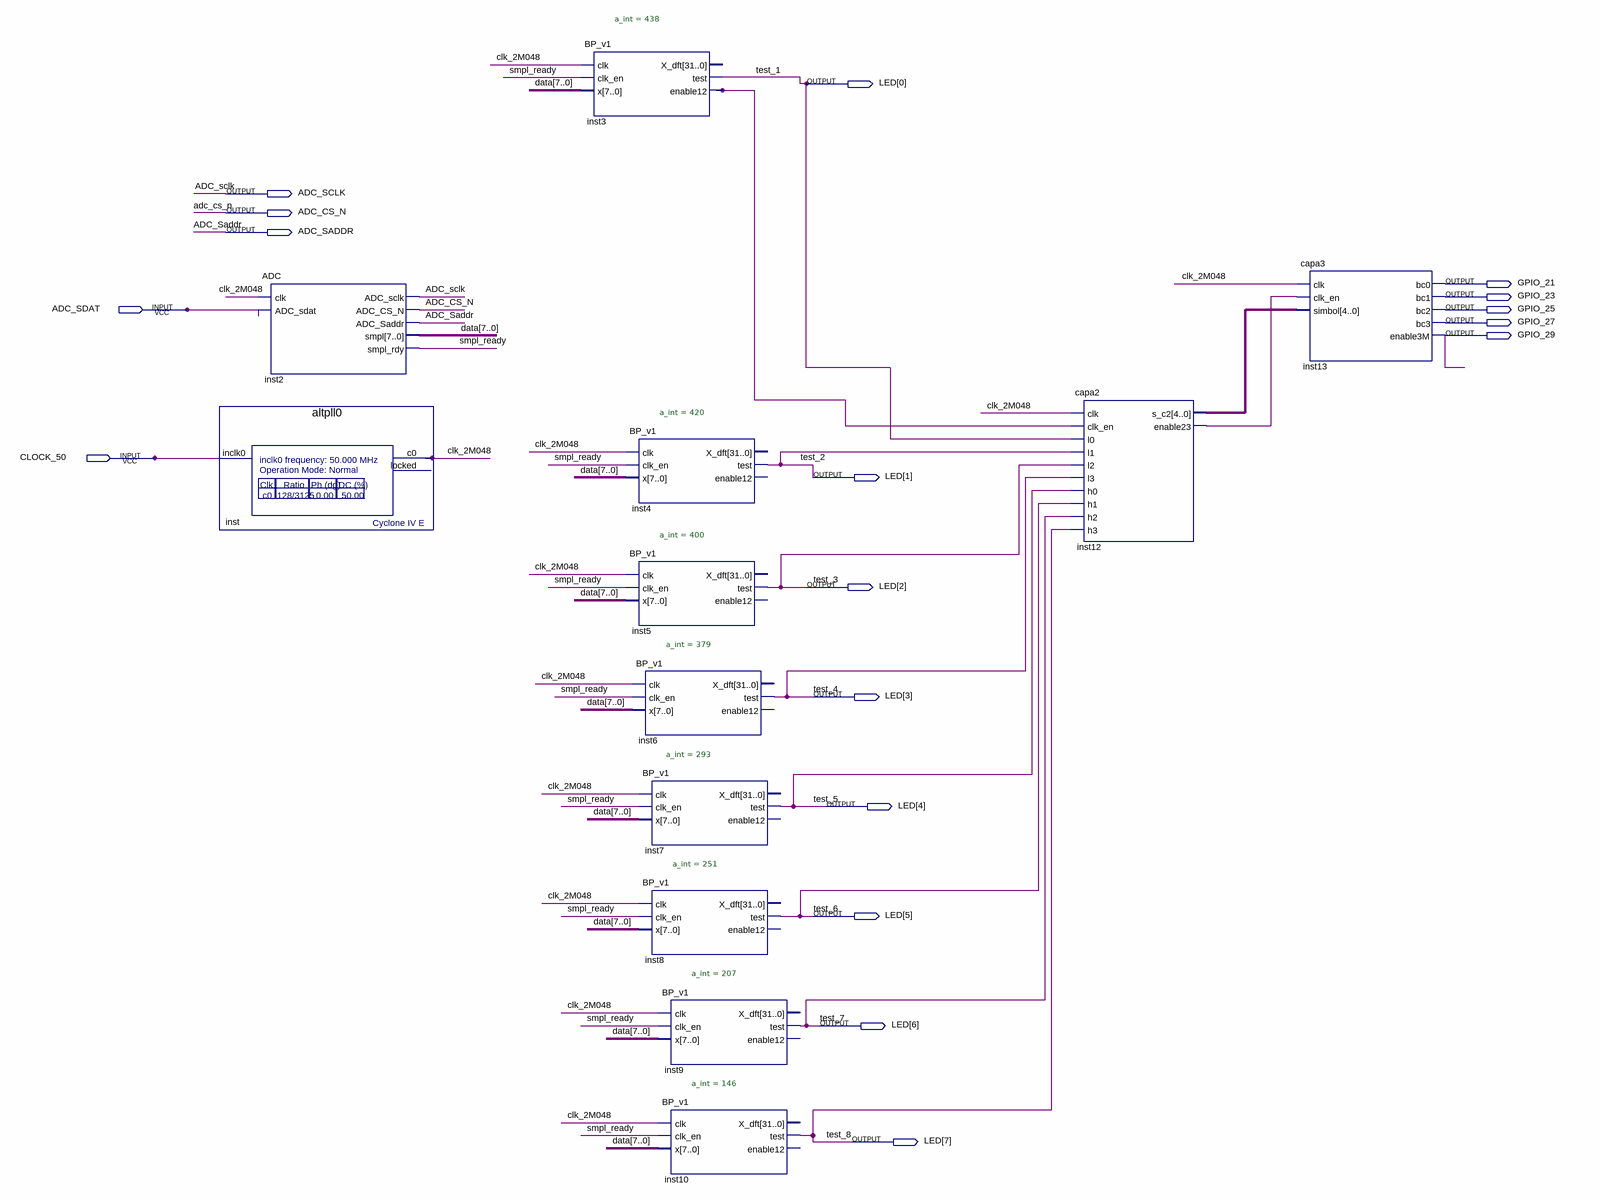
[diagram p0: schematic sheet]
// Quartus schematic main.bdf as structural Verilog: 12 symbols, 18 pins
module main (
  input  ADC_SDAT,
  input  CLOCK_50,
  output [7:0] LED,
  output ADC_SCLK,
  output ADC_CS_N,
  output ADC_SADDR,
  output GPIO_21,
  output GPIO_23,
  output GPIO_25,
  output GPIO_27,
  output GPIO_29
);

  wire clk_2M048, inst3_enable12, inst12_enable23, smpl_ready;
  wire [4:0] inst12_s_c2;
  wire [7:0] data;

  ADC inst2 (
    .clk(clk_2M048), .ADC_sdat(ADC_SDAT), .ADC_sclk(ADC_SCLK), .ADC_CS_N(ADC_CS_N), .ADC_Saddr(ADC_SADDR),
    .smpl(data), .smpl_rdy(smpl_ready));
  altpll0 inst (.inclk0(CLOCK_50), .c0(clk_2M048));  // open: locked
  BP_v1 #(.a_int(438)) inst3 (
    .clk(clk_2M048), .clk_en(smpl_ready), .x(data), .test(LED[0]), .enable12(inst3_enable12));  // open: X_dft
  BP_v1 #(.a_int(420)) inst4 (.clk(clk_2M048), .clk_en(smpl_ready), .x(data), .test(LED[1]));  // open: X_dft, enable12
  BP_v1 #(.a_int(400)) inst5 (.clk(clk_2M048), .clk_en(smpl_ready), .x(data), .test(LED[2]));  // open: X_dft, enable12
  BP_v1 #(.a_int(379)) inst6 (.clk(clk_2M048), .clk_en(smpl_ready), .x(data), .test(LED[3]));  // open: X_dft, enable12
  BP_v1 #(.a_int(293)) inst7 (.clk(clk_2M048), .clk_en(smpl_ready), .x(data), .test(LED[4]));  // open: X_dft, enable12
  BP_v1 #(.a_int(251)) inst8 (.clk(clk_2M048), .clk_en(smpl_ready), .x(data), .test(LED[5]));  // open: X_dft, enable12
  BP_v1 #(.a_int(207)) inst9 (.clk(clk_2M048), .clk_en(smpl_ready), .x(data), .test(LED[6]));  // open: X_dft, enable12
  BP_v1 #(.a_int(146)) inst10 (.clk(clk_2M048), .clk_en(smpl_ready), .x(data), .test(LED[7]));  // open: X_dft, enable12
  capa2 inst12 (
    .clk(clk_2M048), .clk_en(inst3_enable12), .l0(LED[0]), .l1(LED[1]), .l2(LED[2]), .l3(LED[3]),
    .h0(LED[4]), .h1(LED[5]), .h2(LED[6]), .h3(LED[7]), .s_c2(inst12_s_c2), .enable23(inst12_enable23));
  capa3 inst13 (
    .clk(clk_2M048), .clk_en(inst12_enable23), .simbol(inst12_s_c2), .bc0(GPIO_21), .bc1(GPIO_23),
    .bc2(GPIO_25), .bc3(GPIO_27), .enable3M(GPIO_29));

  // Other names for the same wires on the sheet: test_1 = LED[0]; test_2 = LED[1]; test_3 = LED[2]; test_4 = LED[3];
  //   test_5 = LED[4]; test_6 = LED[5]; test_7 = LED[6]; test_8 = LED[7]
endmodule
